# Altium schematic sheet 03.SchDoc
size 420 x 297 mm
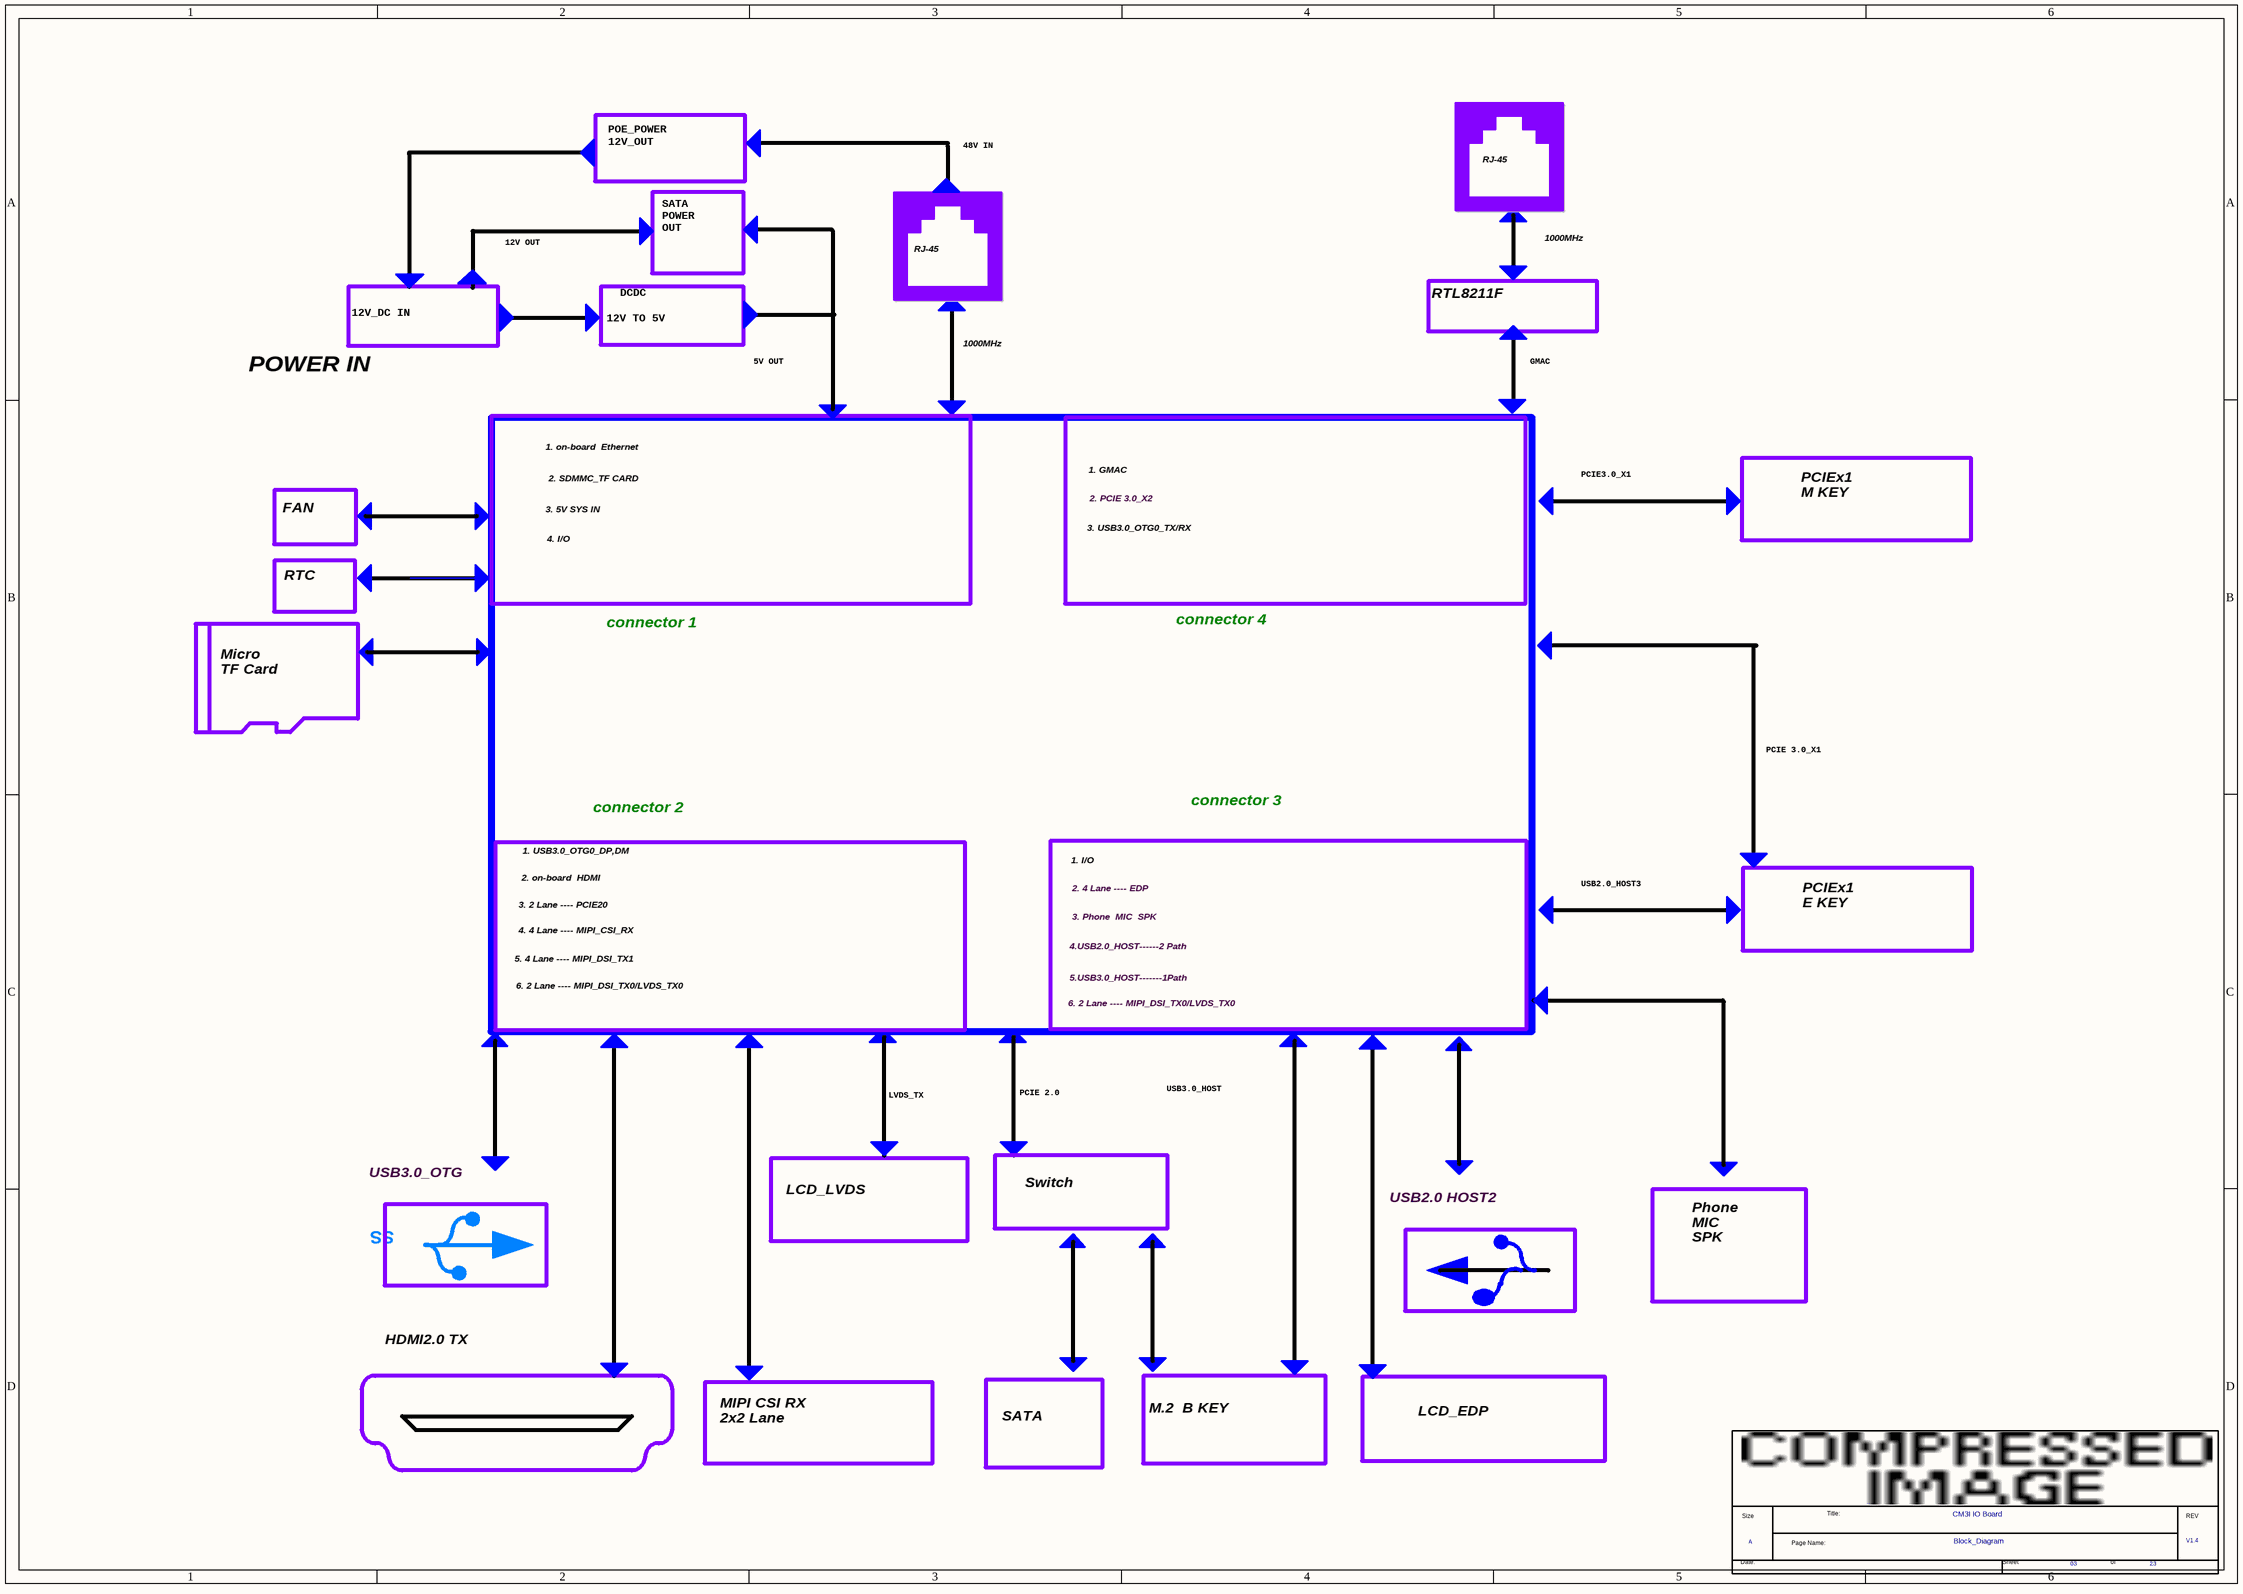
[diagram p0: 03.SchDoc]

## Parts
*  Page Count: 23  Page Number: 03  Page Size: A  Title: CM3I IO Board  RevCode: V1.4  Doc: Block_Diagram  (hidden comment: radxa_1010)  (graphical)

## Notes on the sheet
- POE_POWER
  12V_OUT
- SATA
  POWER
  OUT
- 48V IN
- RJ-45
- 12V OUT
- 1000MHz
- 12V_DC IN
- 12V TO 5V
- DCDC
- RTL8211F
- POWER IN
- 5V OUT
- GMAC
- 1. on-board  Ethernet
- PCIEx1
  M KEY
- FAN
- 3. 5V SYS IN
- 2. SDMMC_TF CARD
- 3. USB3.0_OTG0_TX/RX
- 1. GMAC
- 2. PCIE 3.0_X2
- PCIE3.0_X1
- RTC
- 4. I/O
- Micro
  TF Card
- connector 1
- connector 4
- PCIE 3.0_X1
- 1. USB3.0_OTG0_DP,DM
- connector 2
- 1. I/O
- connector 3
- 4. 4 Lane ---- MIPI_CSI_RX
- 3. 2 Lane ---- PCIE20
- 2. on-board  HDMI
- 2. 4 Lane ---- EDP
- 3. Phone  MIC  SPK
- USB2.0_HOST3
- PCIEx1
  E KEY
- 5. 4 Lane ---- MIPI_DSI_TX1
- 6. 2 Lane ---- MIPI_DSI_TX0/LVDS_TX0
- 4.USB2.0_HOST------2 Path
- 5.USB3.0_HOST-------1Path
- LVDS_TX
- PCIE 2.0
- USB3.0_HOST
- USB3.0_OTG
- LCD_LVDS
- Switch
- USB2.0 HOST2
- Phone
  MIC
  SPK
- SS
- HDMI2.0 TX
- MIPI CSI RX
  2x2 Lane
- SATA
- M.2  B KEY
- LCD_EDP
- (in symbol radxa_1010) Title:; Size; REV; Page Name:; Date:; Sheet; of

## Library data of the parts
* = radxa_1010: Page Create Date: March  8, 1995